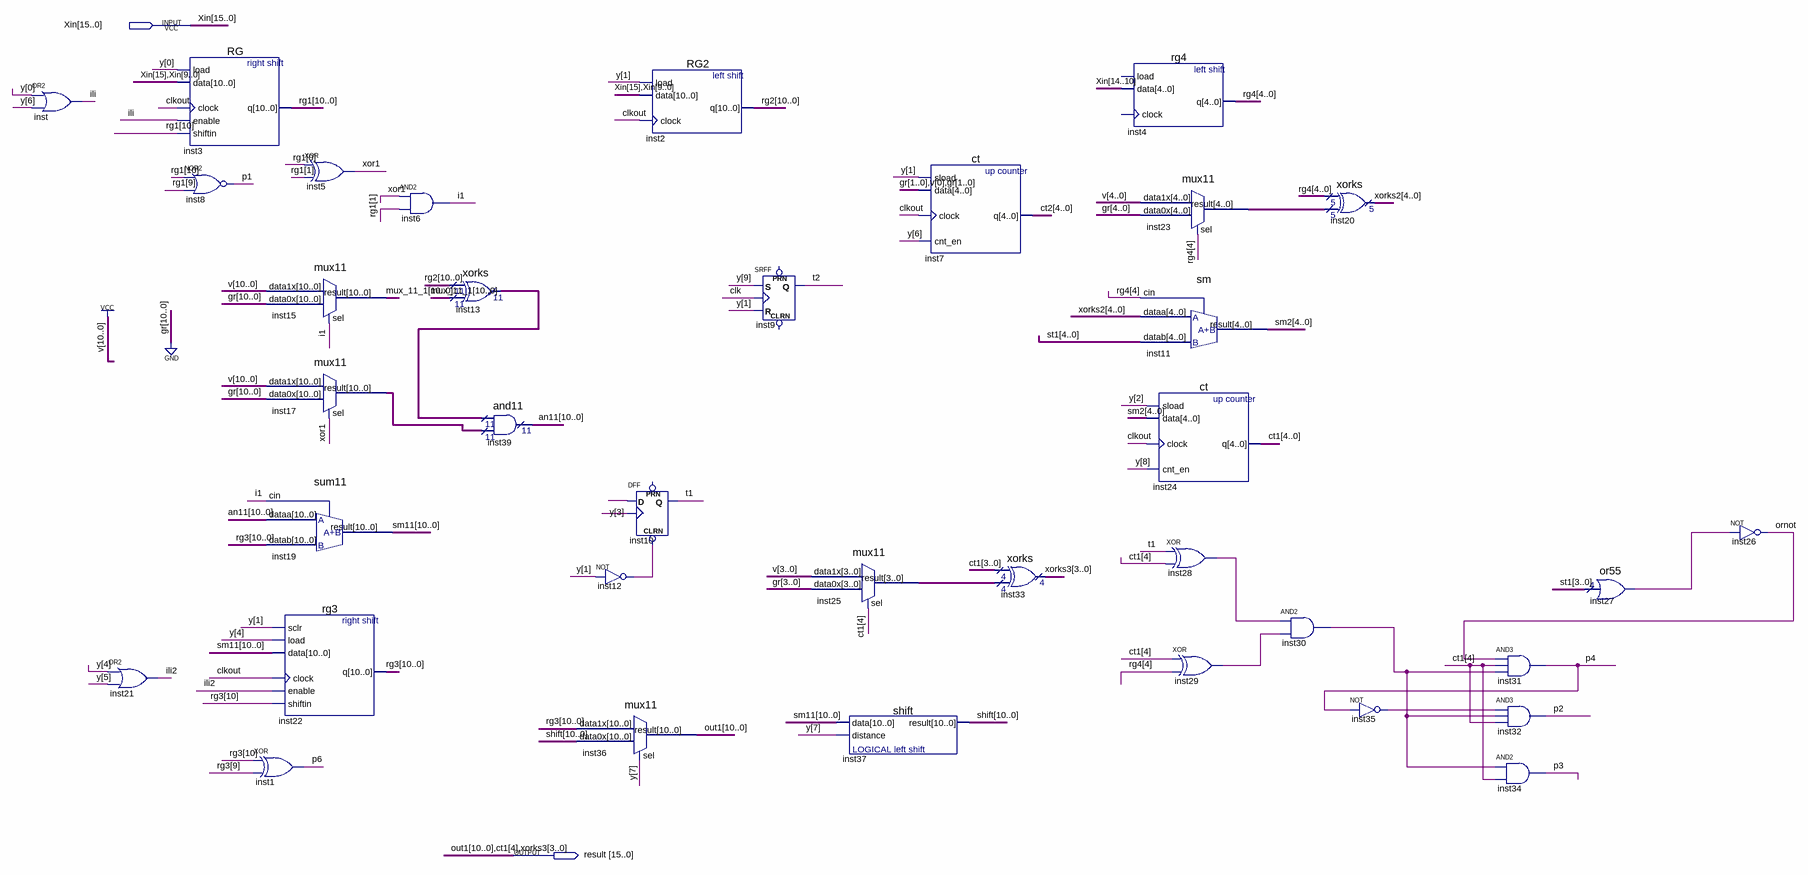
[diagram p0: schematic sheet]
// Quartus schematic Test.bdf as structural Verilog: 36 symbols, 2 pins
module Test (
  input  [15:0] Xin,
  output [15:0] result
);

  wire clk, clkout, i1, ili, ili2, inst12_out, inst27_result, inst28_out, inst29_out, inst30_out, inst35_out,
       ornot, p1, p2, p3, p4, p6, t1, t2, undriven, xor1;
  wire [3:0] ct1, inst25_result;
  wire [4:0] ct2, inst23_result, rg4, sm2, st1, xorks2;
  wire [9:0] y;
  wire [10:0] an11, inst13_result, inst17_result, mux_11_1, rg1, rg2, rg3, shift, sm11;

  or inst (ili, y[0], y[6]);
  or inst21 (ili2, y[4], y[5]);
  RG inst3 (.load(y[0]), .data({Xin[15], Xin[9:0]}), .clock(clkout), .enable(ili), .shiftin(rg1[10]), .q(rg1));
  nor inst8 (p1, rg1[10], rg1[9]);
  mux11 inst15 (.data1x({11{1'b1}}), .data0x({11{1'b0}}), .sel(i1), .result(mux_11_1));
  mux11 inst17 (.data1x({11{1'b1}}), .data0x({11{1'b0}}), .sel(xor1), .result(inst17_result));
  sum11 inst19 (.dataa(an11), .datab(rg3), .cin(i1), .result(sm11));
  rg3 inst22 (.sclr(y[1]), .load(y[4]), .data(sm11), .clock(clkout), .enable(ili2), .shiftin(rg3[10]), .q(rg3));
  xor inst1 (p6, rg3[10], rg3[9]);
  xor inst5 (xor1, rg1[0], rg1[1]);
  and inst6 (i1, xor1, rg1[1]);
  xorks inst13 (.data0x(rg2), .data1x(mux_11_1), .result(inst13_result));
  and11 inst39 (.data0x(inst13_result), .data1x(inst17_result), .result(an11));
  not inst12 (inst12_out, y[1]);
  mux11 inst36 (.data1x(rg3), .data0x(shift), .sel(y[7]), .result(result[15:5]));
  RG2 inst2 (.load(y[1]), .data({Xin[15], Xin[9:0]}), .clock(clkout), .q(rg2));
  DFF inst10 (.CLRN(inst12_out), .CLK(y[3]), .D(undriven), .Q(t1));  // open: PRN
  SRFF inst9 (.S(y[9]), .R(y[1]), .CLK(clk), .Q(t2));  // open: PRN, CLRN
  mux11 inst25 (.data1x(4'b1111), .data0x(4'b0000), .sel(result[4]), .result(inst25_result));
  shift inst37 (.data(sm11), .distance(y[7]), .result(shift));
  ct inst7 (.sload(y[1]), .data(5'b00100), .clock(clkout), .cnt_en(y[6]), .q(ct2));
  xorks inst33 (.data0x(ct1), .data1x(inst25_result), .result(result[3:0]));
  rg4 inst4 (.data(Xin[14:10]), .q(rg4));  // open: load, clock
  mux11 inst23 (.data1x({5{1'b1}}), .data0x({5{1'b0}}), .sel(rg4[4]), .result(inst23_result));
  sm inst11 (.dataa(xorks2), .datab(st1), .cin(rg4[4]), .result(sm2));
  ct inst24 (.sload(y[2]), .data(sm2), .clock(clkout), .cnt_en(y[8]), .q({result[4], ct1}));
  xor inst28 (inst28_out, t1, result[4]);
  xor inst29 (inst29_out, result[4], rg4[4]);
  and inst30 (inst30_out, inst28_out, inst29_out);
  xorks inst20 (.data0x(rg4), .data1x(inst23_result), .result(xorks2));
  not inst35 (inst35_out, p4);
  and inst31 (p4, ornot, result[4], inst30_out);
  and inst32 (p2, inst35_out, inst30_out, result[4]);
  and inst34 (p3, inst30_out, result[4]);
  or55 inst27 (.data(st1[3:0]), .result(inst27_result));
  not inst26 (ornot, inst27_result);

  // Other names for the same wires on the sheet: ct1[4] = result[4]; out1[10:0] = result[15:5];
  //   xorks3[3:0] = result[3:0]
endmodule
